# Altium schematic sheet 03_Power_Buck_24V_3.3V.SchDoc: Buck converter 24VDC to 3.3VDC
size A4; SheetNumber: 4; SheetTotal: 4
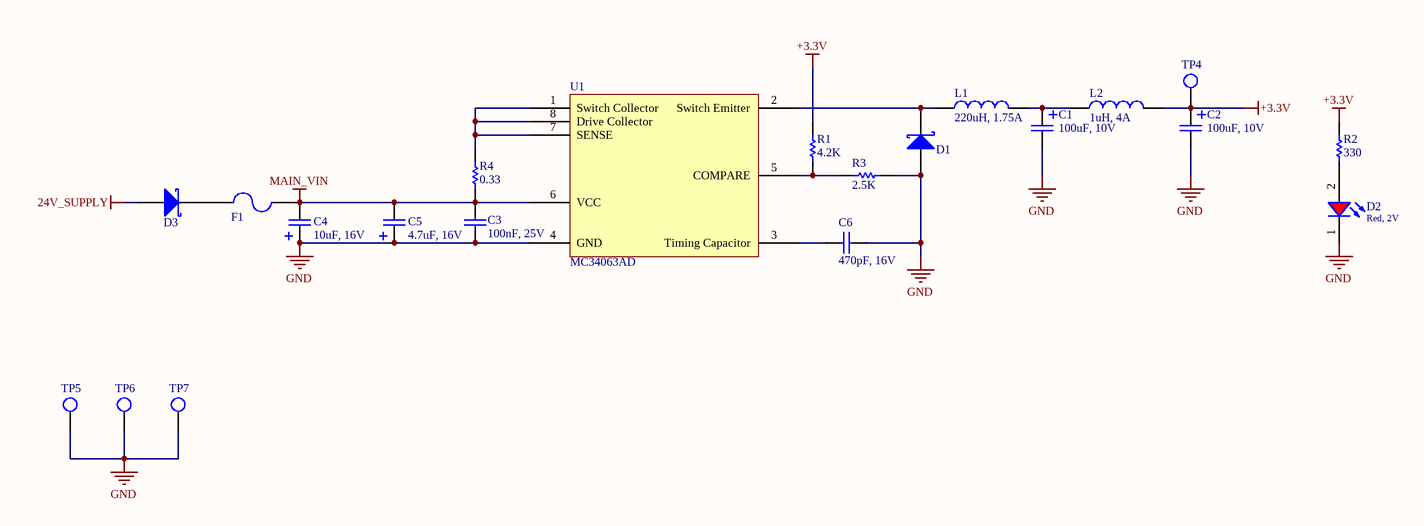
[diagram p0: 03_Power_Buck_24V_3.3V.SchDoc]

## Parts
C1  value 100uF, 10V  [TAN1210]  (hidden comment: Tantalum Capacitor)
C2  value 100uF, 10V  [TAN1210]  (hidden comment: Tantalum Capacitor)
C3  100nF, 25V  [WCAP-CSGP_0603_H=0.8mm_Reflow]
C4  value 10uF, 16V  [TAN1206]  (hidden comment: Tantalum Capacitor)
C5  value 4.7uF, 16V  [TAN1206]  (hidden comment: Tantalum Capacitor)
C6  470pF, 16V  [WCAP-CSGP_0603_H=0.8mm_Reflow]
D1  D Schottky  [SS34]  (value not drawn)
D2  Red, 2V  [WL-SMCW_0603_H=0.7mm]
D3  D Schottky  [SS34]  (value not drawn)
F1  Fuse  [FUSE SMD]  (value not drawn)
L1  220uH, 1.75A  [WE-PD2A_5848]
L2  1uH, 4A  [WE-PD2A_4532]
R1  value 4.2K  [RES-SM-0603]  (hidden comment: RESISTOR SMD)
R2  value 330  [RES-SM-0603]  (hidden comment: RESISTOR SMD)
R3  value 2.5K  [RES-SM-0603]  (hidden comment: RESISTOR SMD)
R4  value 0.33  [RES-SM-0805]  (hidden comment: RESISTOR SMD)
TP4  Test point  [TP]  (value not drawn)
TP5  Test point  [TP]  (value not drawn)
TP6  Test point  [TP]  (value not drawn)
TP7  Test point  [TP]  (value not drawn)
U1  MC34063AD  [SOIC127P600X170-8N]

## Nets
24V_SUPPLY: D3.1(A)
+3.3V: C2.1 L2.2 R1.2 R2.2 TP4.1
GND: C1.2 C2.2 C3.1 C4.1 C5.1 C6.2 D1.1(A) D2.1(K) R3.1 TP5.1 TP6.1 TP7.1 U1.4(GND)
MAIN_VIN: C3.2 C4.2 C5.2 F1.2 R4.1 U1.6(VCC)
NetC1_1: C1.1 L1.2 L2.1
NetC6_1: C6.1 U1.3(Timing_Capacitor)
NetD1_2: D1.2(K) L1.1 U1.2(Switch_Emitter)
NetD2_2: D2.2(A) R2.1
NetD3_2: D3.2(K) F1.1
NetR1_1: R1.1 R3.2 U1.5(COMPARE)
NetR4_2: R4.2 U1.1(Switch_Collector) U1.7(SENSE) U1.8(Drive_Collector)

## Notes on the sheet
- APPROVALS
- DATE
- PROJECT
- BOM:
- REFERENCE DOCUMENTS
- TITLE
- PROJECT REVISION
- DOCUMENT REVISION
- ASSY DWG:
- FAB DWG:
- PCB DWG:
- SIZE:
- A4
- FILE NAME:
- REV
- SHEET
- OF

## Library data of the parts
C3 = 885012206071: WCAP-CSGP Multilayer Ceramic Chip Capacitor, General Purpose, size 0603, X7R, 100nF, 25V; Manufacturer: Wurth Elektronik; Rated Voltage: 25VDC; Isolation Resistance: >=5GOhm; Capacitance Tolerance: +/-10%; Technical Reference: X7R0603104K025DFCT10000; ComponentLink1Description: Manufacturer; ComponentLink1URL: http://www.we-online.de; ComponentLink2Description: Datasheet; ComponentLink2URL: https://www.we-online.com/catalog/datasheet/885012206071.pdf; Operating Temperature: -55 to +125degC; Packaging: Tape and Reel; Manufacturer Part Number: 885012206071; Published Date: May 2020; Ceramic Type: X7R; Dissipation Factor: =<3.5%; Height: 0.8mm; Mounting Technology: SMT; Size: 0603; Capacitance: 100nF
C6 = 885012006027: WCAP-CSGP Multilayer Ceramic Chip Capacitor, General Purpose, size 0603, NP0, 470pF, 16V; Manufacturer: Wurth Elektronik; Rated Voltage: 16VDC; Isolation Resistance: >=10GOhm; Capacitance Tolerance: +/-5%; Dissipation Factor: Q>=1000; Technical Reference: NP00603471J016DFCT10000; ComponentLink1Description: Manufacturer; ComponentLink1URL: http://www.we-online.de; ComponentLink2Description: Datasheet; ComponentLink2URL: https://www.we-online.com/catalog/datasheet/885012006027.pdf; Operating Temperature: -55 to +125degC; Packaging: Tape and Reel; Manufacturer Part Number: 885012006027; Published Date: May 2020; Ceramic Type: NP0; Height: 0.8mm; Mounting Technology: SMT; Size: 0603; Capacitance: 470pF
D1 D3 = D Schottky: Schottky Diode; Published: 8-Jun-2000; LatestRevisionDate: 17-Jul-2002; LatestRevisionNote: Re-released for DXP Platform.; PackageReference: SMB; Publisher: Altium Limited; PackageDescription: DO-214-AA/SMB; 2 C-Bend Leads; Body 5.3 x 3.6 mm, inc. leads (LxW); Code_JEDEC: DO-214-AA
D2 = 150060RS75000: WL-SMCW SMT Mono-color Chip LED Waterclear, size 0603, Red, 2V, 140deg; Chip Technology: AlInGaP; Dominant Wavelength typ.: 625nm; Luminous Intensity typ.: 250mcd; Peak Wavelength typ.: 630nm; Viewing Angle: 140deg; ComponentLink1Description: Manufacturer; ComponentLink1URL: http://www.we-online.de; ComponentLink2URL: https://www.we-online.com/catalog/datasheet/150060RS75000.pdf; ComponentLink2Description: Datasheet; Forward Voltage typ.: 2V; Emitting Color: Red; Mounting Technology: SMT; Operating Temperature: -40 to +85degC; Published Date: December 2019; Part Number: 150060RS75000; Packaging: Tape and Reel; Size: 0603; Publisher: Wurth Elektronik
L1 = 784774222: WE-PD2A SMT Power Inductor, size 5848, 220uH, 0.41A; Manufacturer: Wurth Elektronik; DC Resistance max.: 1.57Ohm; Saturation Current: 0.47A; Self Resonant Frequency: 5MHz; DC Resistance typ.: 0.945Ohm; Rated Voltage: 80VDC; ComponentLink1Description: Manufacturer; ComponentLink1URL: http://www.we-online.de; ComponentLink2Description: Datasheet; ComponentLink2URL: https://www.we-online.com/catalog/datasheet/784774222.pdf; Manufacturer Part Number: 784774222; Published Date: May 2020; Rated Current: 0.41A; Inductance: 220uH; Operating Temperature: -40 to +125degC; Mounting Technology: SMT; Packaging: Tape and Reel; Size: 5848
L2 = 7847730: WE-PD2A SMT Power Inductor, size 4532, 1uH, 4A; Manufacturer: Wurth Elektronik; DC Resistance max.: 0.049Ohm; Saturation Current: 5.72A; Self Resonant Frequency: 110MHz; DC Resistance typ.: 0.014Ohm; Rated Voltage: 80VDC; ComponentLink1Description: Manufacturer; ComponentLink1URL: http://www.we-online.de; ComponentLink2Description: Datasheet; ComponentLink2URL: https://www.we-online.com/catalog/datasheet/7847730.pdf; Manufacturer Part Number: 7847730; Published Date: May 2020; Rated Current: 4A; Inductance: 1uH; Operating Temperature: -40 to +125degC; Mounting Technology: SMT; Packaging: Tape and Reel; Size: 4532
R1-R4 = RESISTOR SMD: Resistor
TP4-TP7 = TP: ComponentLink1Description: Supplier 1 Link
U1 = MC34063: 1.5-A boost, buck, inverting switching regulator, operation from 0°C to 70°C; Manufacturer: Texas Instruments; ComponentLink1Description: Local Supplier Link; ComponentLink1URL: https://www.thegioiic.com/products/mc34063ad-ic-dieu-chinh-tang-giam-ap-1-5a-8-soic; Local Supplier: Thegioiic; Local Supplier P/N: MC34063AD; Manufacturer P/N: MC34063AD